# EAGLE schematic BMSChargerV1 (EAGLE 7.6.0)
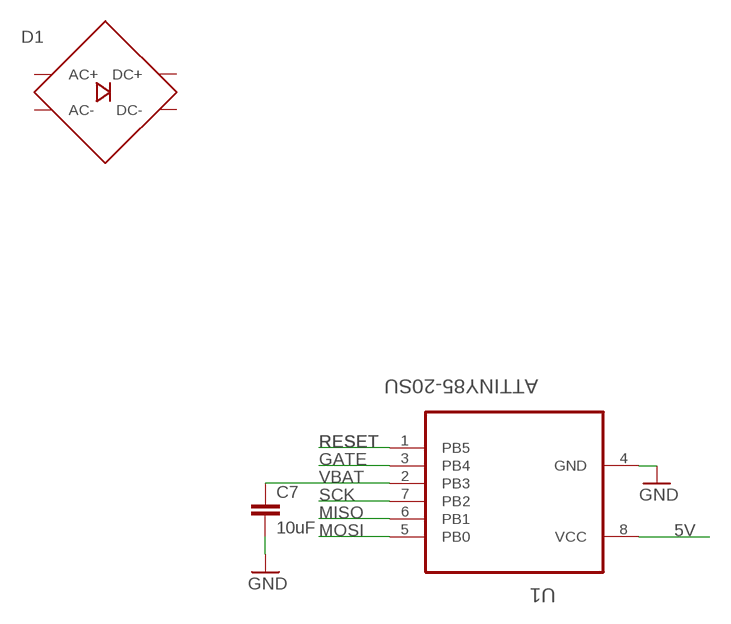
[diagram p0: schematic, sheet 1]

## Parts
C7  10uF  10UF10V10%(0805)  [0805-CAP]
D1  RECTRIFIER_BRIDGE_4  [MP-50]
U1  ATTINY85-20SU  [SOIC127P798X216-8N]

## Nets
5V: U1.8(VCC)
GATE: U1.3(PB4)
GND: C7.2 U1.4(GND)
MISO: U1.6(PB1)
MOSI: U1.5(PB0)
RESET: U1.1(PB5)
SCK: U1.7(PB2)
VBAT: C7.1 U1.2(PB3)
Unconnected: D1.+1(DC+) D1.+(DC+) D1.-1(DC-) D1.-(DC-) D1.AC1(AC+) D1.AC1-(AC-) D1.AC2(AC+) D1.AC2-(AC-)

## Library data of the parts
C7 = SparkFun-Capacitors:10UF10V10%(0805): CAP-11330; PROD_ID: CAP-11330
D1 = lolomolo:RECTRIFIER_BRIDGE_4
U1 = Atmel_By_element14_Batch_1-00:ATTINY85-20SU: 8-bit Microcontroller with In-System Programmable Flash; MPN: ATTINY85-20SU; OC_FARNELL: 1455164; OC_NEWARK: 58M3797; PACKAGE: SOIC-8; SUPPLIER: Atmel